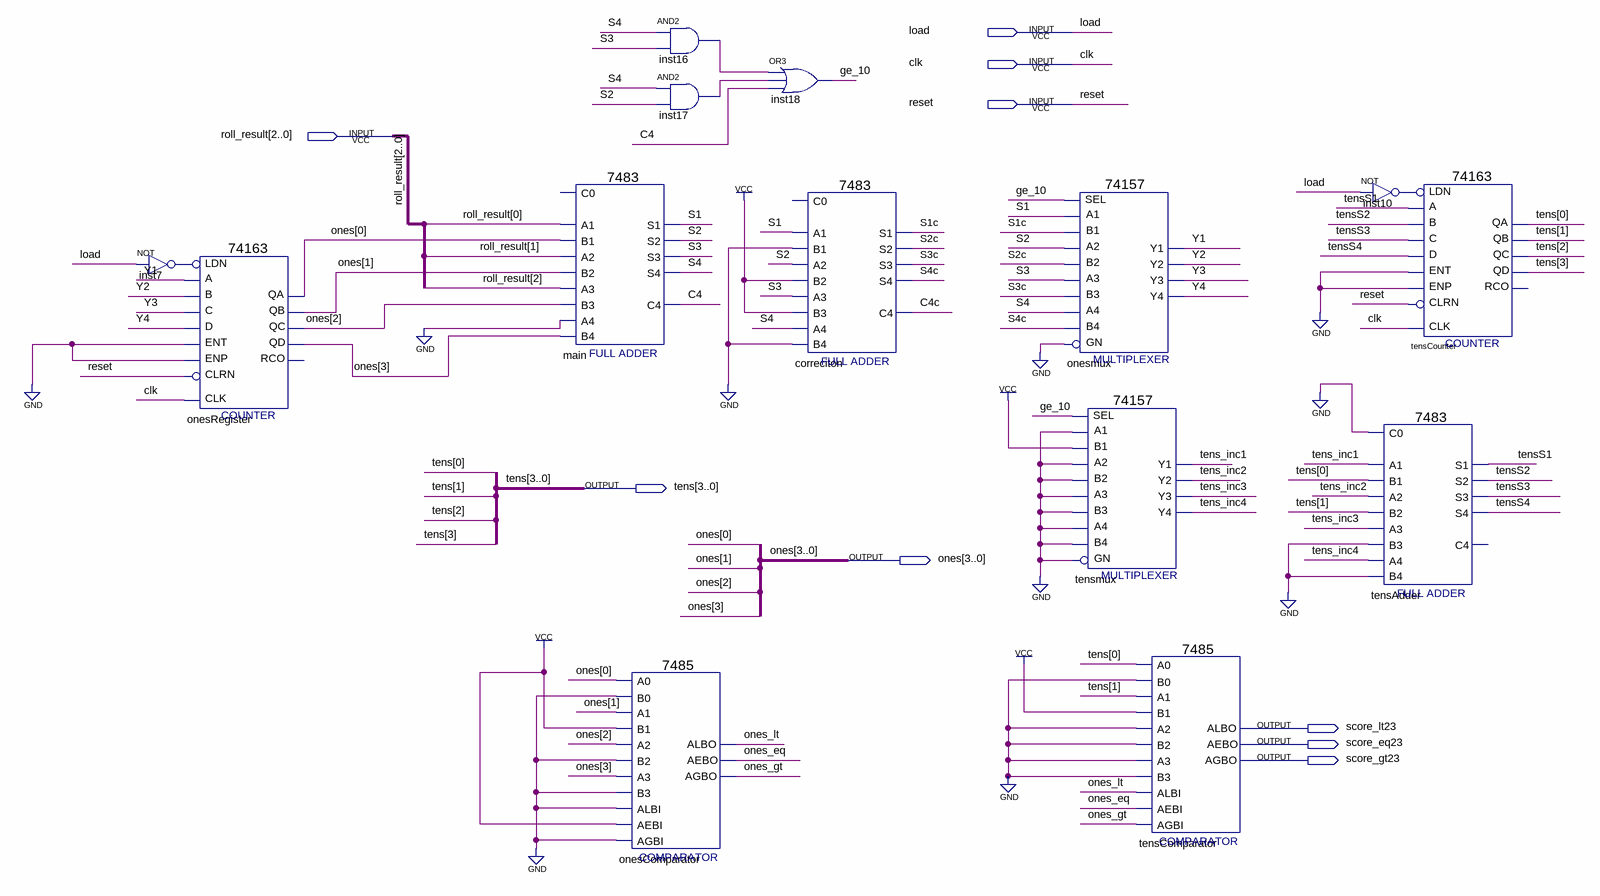
[diagram p0: schematic sheet]
// Quartus schematic scoreProcessingUnit.bdf as structural Verilog: 14 symbols, 9 pins
module scoreProcessingUnit (
  input  load,
  input  clk,
  input  reset,
  input  [2:0] roll_result,
  output [3:0] tens,
  output [3:0] ones,
  output score_lt23,
  output score_eq23,
  output score_gt23
);

  wire C4, C4c, ge_10, inst7_out, inst10_out, inst16_out, inst17_out, ones_eq, ones_gt, ones_lt, S1, S1c, S2,
       S2c, S3, S3c, S4, S4c, tens_inc1, tens_inc2, tens_inc3, tens_inc4, tensS1, tensS2, tensS3, tensS4, Y1,
       Y2, Y3, Y4;

  \74163  onesRegister (
    .C(Y3), .B(Y2), .A(Y1), .ENT(1'b0), .D(Y4), .CLRN(reset), .CLK(clk), .ENP(1'b0), .LDN(inst7_out),
    .QA(ones[0]), .QB(ones[1]), .QC(ones[2]), .QD(ones[3]));  // open: RCO
  not inst7 (inst7_out, load);
  \7483  main (
    .B4(ones[3]), .A1(roll_result[0]), .A2(roll_result[1]), .B1(ones[0]), .B2(ones[1]), .A3(roll_result[2]),
    .B3(ones[2]), .A4(1'b0), .S3(S3), .S4(S4), .S2(S2), .C4(C4), .S1(S1));  // open: C0
  \7485  onesComparator (
    .A3(ones[3]), .B2(1'b0), .A2(ones[2]), .AEBI(1'b1), .AGBI(1'b0), .ALBI(1'b0), .A0(ones[0]), .B0(1'b0),
    .B3(1'b0), .A1(ones[1]), .B1(1'b1), .ALBO(ones_lt), .AGBO(ones_gt), .AEBO(ones_eq));
  and inst16 (inst16_out, S4, S3);
  and inst17 (inst17_out, S4, S2);
  or inst18 (ge_10, inst16_out, inst17_out, C4);
  \7483  correciton (
    .B4(1'b0), .A1(S1), .A2(S2), .B1(1'b0), .B2(1'b1), .A3(S3), .B3(1'b1), .A4(S4), .S3(S3c), .S4(S4c),
    .S2(S2c), .C4(C4c), .S1(S1c));  // open: C0
  \74157  onesmux (
    .A1(S1), .B1(S1c), .SEL(ge_10), .B2(S2c), .A3(S3), .B3(S3c), .A2(S2), .B4(S4c), .GN(1'b0), .A4(S4),
    .Y2(Y2), .Y1(Y1), .Y4(Y4), .Y3(Y3));
  \74157  tensmux (
    .A1(1'b0), .B1(1'b1), .SEL(ge_10), .B2(1'b0), .A3(1'b0), .B3(1'b0), .A2(1'b0), .B4(1'b0), .GN(1'b0),
    .A4(1'b0), .Y2(tens_inc2), .Y1(tens_inc1), .Y4(tens_inc4), .Y3(tens_inc3));
  \7485  tensComparator (
    .A3(1'b0), .B2(1'b0), .A2(1'b0), .AEBI(ones_eq), .AGBI(ones_gt), .ALBI(ones_lt), .A0(tens[0]), .B0(1'b0),
    .B3(1'b0), .A1(tens[1]), .B1(1'b1), .ALBO(score_lt23), .AGBO(score_gt23), .AEBO(score_eq23));
  not inst10 (inst10_out, load);
  \7483  tensAdder (
    .B4(1'b0), .C0(1'b0), .A1(tens_inc1), .A2(tens_inc2), .B1(tens[0]), .B2(tens[1]), .A3(tens_inc3),
    .B3(1'b0), .A4(tens_inc4), .S3(tensS3), .S4(tensS4), .S2(tensS2), .S1(tensS1));  // open: C4
  \74163  tensCounter (
    .C(tensS3), .B(tensS2), .A(tensS1), .ENT(1'b0), .D(tensS4), .CLRN(reset), .CLK(clk), .ENP(1'b0),
    .LDN(inst10_out), .QA(tens[0]), .QB(tens[1]), .QC(tens[2]), .QD(tens[3]));  // open: RCO
endmodule
